# EAGLE design Driver Stage (EAGLE 5.07)
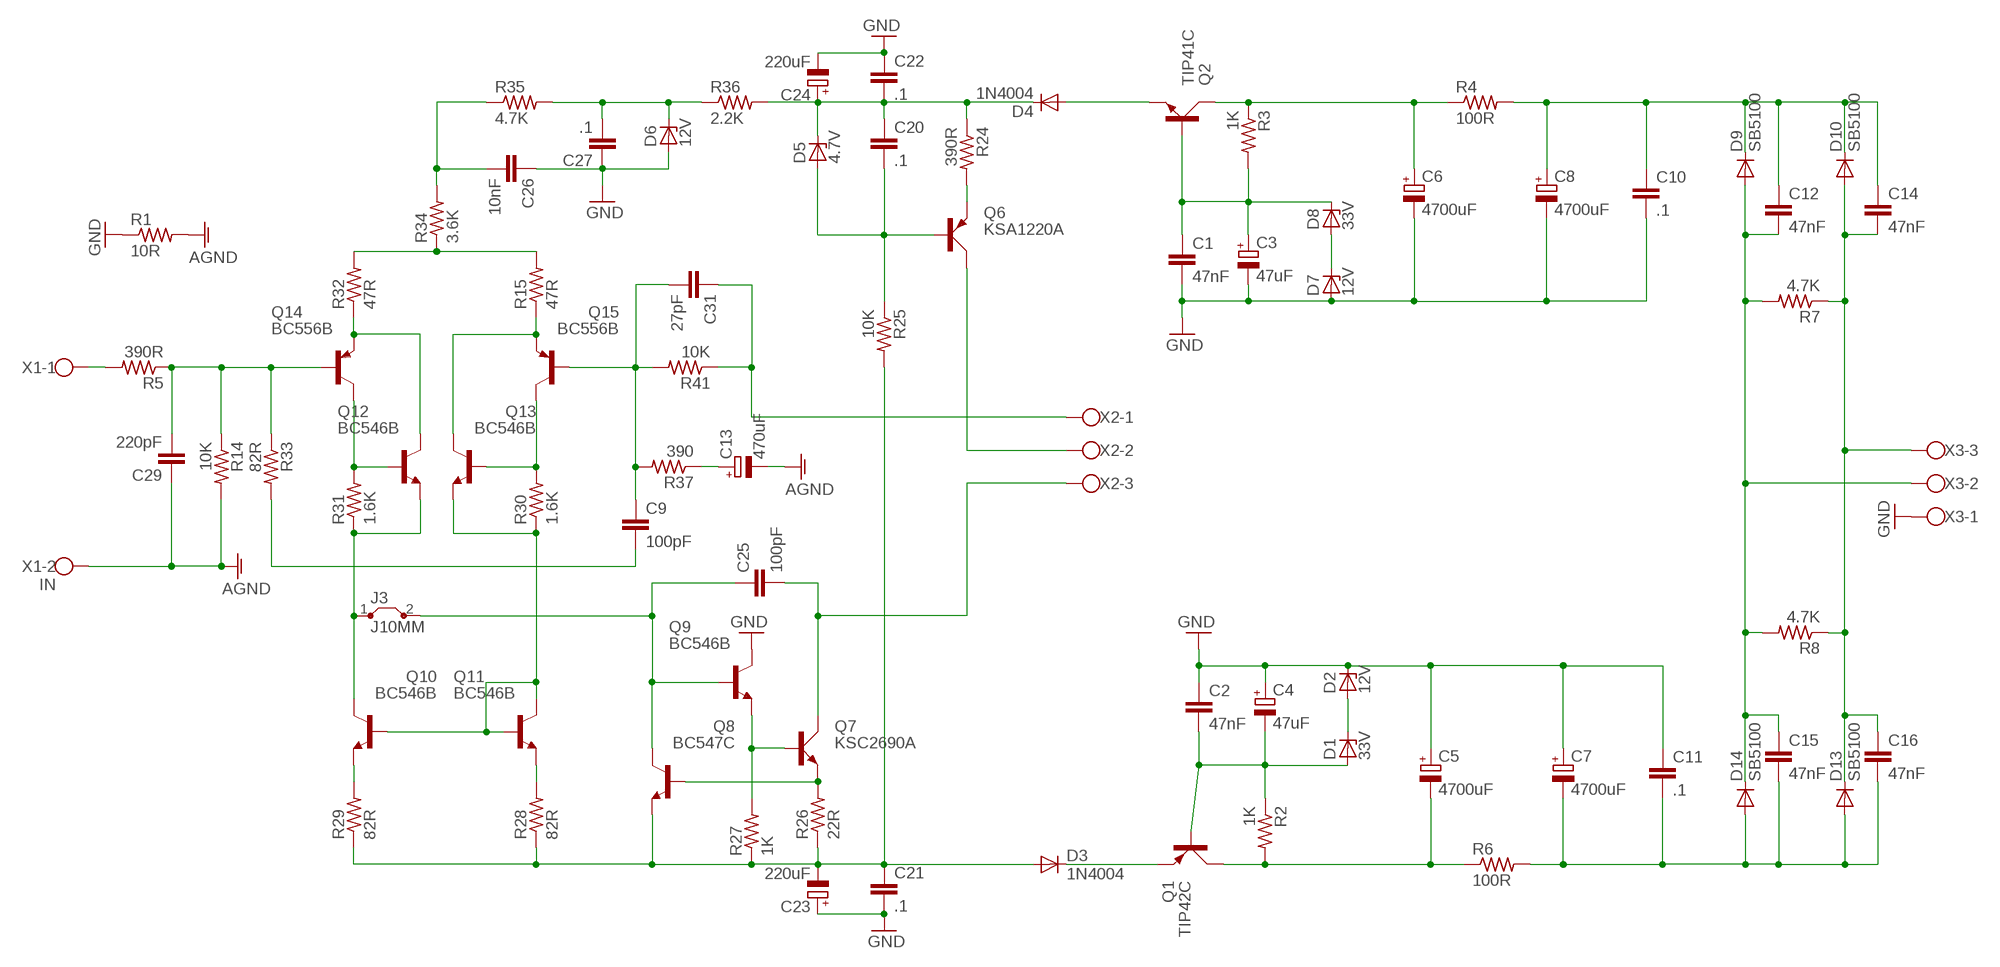
[diagram p0: schematic, sheet 1]

## Parts
C1  47nF  C-EU050-035X075  [C050-035X075]
C2  47nF  C-EU050-035X075  [C050-035X075]
C3  47uF  CPOL-EUE5-10.5  [E5-10,5]
C4  47uF  CPOL-EUE5-10.5  [E5-10,5]
C5  4700uF  CPOL-EUE10-22.5  [EB22,5D]
C6  4700uF  CPOL-EUE10-22.5  [EB22,5D]
C7  4700uF  CPOL-EUE10-22.5  [EB22,5D]
C8  4700uF  CPOL-EUE10-22.5  [EB22,5D]
C9  100pF  C-EU102-043X133  [C102-043X133]
C10  .1  C-EU102-043X133  [C102-043X133]
C11  .1  C-EU102-043X133  [C102-043X133]
C12  47nF  C-EU050-035X075  [C050-035X075]
C13  470uF  CPOL-EUE5-13  [E5-13]
C14  47nF  C-EU050-035X075  [C050-035X075]
C15  47nF  C-EU050-035X075  [C050-035X075]
C16  47nF  C-EU050-035X075  [C050-035X075]
C20  .1  C-EU102-043X133  [C102-043X133]
C21  .1  C-EU102-043X133  [C102-043X133]
C22  .1  C-EU102-043X133  [C102-043X133]
C23  220uF  CPOL-EUE5-13  [E5-13]
C24  220uF  CPOL-EUE5-13  [E5-13]
C25  100pF  C-EU102-043X133  [C102-043X133]
C26  10nF  C-EU050-030X075  [C050-030X075]
C27  .1  C-EU102-043X133  [C102-043X133]
C29  220pF  C-EU050-030X075  [C050-030X075]
C31  27pF  C-EU102-043X133  [C102-043X133]
D1  33V  ZPY  [DO41Z10]
D2  12V  ZPY  [DO41Z10]
D3  1N4004  [DO41-10]
D4  1N4004  [DO41-10]
D5  4.7V  BZX90  [DO34Z7]
D6  12V  BZX90  [DO34Z7]
D7  12V  ZPY  [DO41Z10]
D8  33V  ZPY  [DO41Z10]
D9  SB5100  GI820  [P6-15]
D10  SB5100  GI820  [P6-15]
D13  SB5100  GI820  [P6-15]
D14  SB5100  GI820  [P6-15]
J3  J10MM  [10]
Q1  TIP42C  [TO220AV]
Q2  TIP41C  [TO220AV]
Q6  KSA1220A  BD140  [TO126AV]
Q7  KSC2690A  BD139  [TO126AV]
Q8  BC547C  BC547B-NPN-TO92-EBC  [TO92-EBC]
Q9  BC546B  BC546A  [TO92-EBC]
Q10  BC546B  BC546A  [TO92-EBC]
Q11  BC546B  BC546A  [TO92-EBC]
Q12  BC546B  BC546A  [TO92-EBC]
Q13  BC546B  BC546A  [TO92-EBC]
Q14  BC556B  BC556  [TO92-EBC]
Q15  BC556B  BC556  [TO92-EBC]
R1  10R  R-US_0309/12  [0309/12]
R2  1K  R-US_0309/12  [0309/12]
R3  1K  R-US_0309/12  [0309/12]
R4  100R  R-US_0309/12  [0309/12]
R5  390R  R-US_0309/12  [0309/12]
R6  100R  R-US_0309/12  [0309/12]
R7  4.7K  R-US_0617/22  [0617/22]
R8  4.7K  R-US_0617/22  [0617/22]
R14  10K  R-US_0309/12  [0309/12]
R15  47R  R-US_0309/12  [0309/12]
R24  390R  R-US_0309/12  [0309/12]
R25  10K  R-US_0617/22  [0617/22]
R26  22R  R-US_0309/12  [0309/12]
R27  1K  R-US_0309/12  [0309/12]
R28  82R  R-US_0309/12  [0309/12]
R29  82R  R-US_0309/12  [0309/12]
R30  1.6K  R-US_0309/12  [0309/12]
R31  1.6K  R-US_0309/12  [0309/12]
R32  47R  R-US_0309/12  [0309/12]
R33  82R  R-US_0309/12  [0309/12]
R34  3.6K  R-US_0309/12  [0309/12]
R35  4.7K  R-US_0309/12  [0309/12]
R36  2.2K  R-US_0309/12  [0309/12]
R37  390  R-US_0309/12  [0309/12]
R41  10K  R-US_0309/12  [0309/12]
X1  IN  W237-102  [W237-102]
X2  W237-3E  [W237-3E]
X3  W237-3E  [W237-3E]

## Nets
AGND: C13.- C29.1 R1.2 R14.2 X1.2
GND: C1.2 C2.1 C3.- C4.+ C5.+ C6.- C7.+ C8.- C10.2 C11.1 C21.2 C22.1 C23.+ C24.- C26.1 C27.1 D2.C D6.A D7.A Q9.C R1.1 X3.1
N$1: Q6.C X2.2
N$2: D3.C Q1.E
N$3: C31.1 R41.1 X2.1
N$4: D4.A Q2.E
N$5: C1.1 C3.+ D8.C Q2.B R3.2
N$6: C2.2 C4.- D1.A Q1.B R2.1
N$7: C5.- Q1.C R2.2 R6.1
N$8: C6.+ Q2.C R3.1 R4.1
N$9: D1.C D2.A
N$10: D7.C D8.A
N$11: C12.2 C15.1 D9.A D14.C R7.2 R8.2 X3.2
N$12: C8.+ C10.1 C12.1 C14.1 D9.C D10.C R4.2
N$16: C9.2 R33.2
N$17: C29.2 Q14.B R5.1 R14.1 R33.1
N$20: R5.2 X1.1
N$26: C7.- C11.2 C15.2 C16.2 D13.A D14.A R6.2
N$27: C14.2 C16.1 D10.A D13.C R7.1 R8.1 X3.3
N$30: C20.2 D5.A Q6.B R25.1
N$34: C21.1 C23.- D3.A Q8.E R25.2 R26.1 R27.1 R28.1 R29.1
N$35: C20.1 C22.2 C24.+ D4.C D5.C R24.1 R36.2
N$36: Q6.E R24.2
N$38: Q11.E R28.2
N$39: C26.2 R34.2 R35.1
N$40: Q7.B Q9.E R27.2
N$41: Q7.E Q8.B R26.2
N$42: C25.1 J3.2 Q8.C Q9.B
N$43: Q10.E R29.2
N$44: Q13.C Q15.E R15.1
N$45: Q12.B Q14.C R31.2
N$46: Q10.B Q11.B Q11.C Q13.E R30.1
N$47: Q12.C Q14.E R32.1
N$49: R15.2 R32.2 R34.1
N$51: C27.2 D6.C R35.2 R36.1
N$53: C13.+ R37.1
N$54: Q13.B Q15.C R30.2
N$55: C9.1 C31.2 Q15.B R37.2 R41.2
N$60: J3.1 Q10.C Q12.E R31.1
N$65: C25.2 Q7.C X2.3

## Library data of the parts
C1 C2 C9-C12 C14-C16 C20-C22 C25-C27 C29 C31 = resistor:C-EU: CAPACITOR, European symbol
C3-C8 C13 C23 C24 = resistor:CPOL-EU: POLARIZED CAPACITOR, European symbol
D1 D2 D7 D8 = diode:ZPY: Z DIODE 1 W
D3 D4 = diode:1N4004: DIODE general purpose rectifier, 1 A
D5 D6 = diode:BZX90: Z DIODE
D9 D10 D13 D14 = diode:GI820: DIODE fast-recovery silicon diode, 6 A (Diotec)
J3 = jumper:J: Bridge
Q1 = transistor-power:TIP42C: PNP TRANSISTOR
Q2 = transistor-power:TIP41C: NPN TRANSISTOR
Q6 = transistor-power:BD140: PNP TRANSISTOR
Q7 = transistor-power:BD139: NPN TRANSISTOR
Q8 = transistor:*-NPN-: NPN Transistror BF959 corrected 2008.03.06
Q9-Q13 = transistor-npn:BC546*: NPN Transistor
Q14 Q15 = transistor-pnp:BC556*: PNP Transistror
R1-R8 R14 R15 R24-R37 R41 = resistor:R-US_: RESISTOR, American symbol
X1 = con-wago-500:W237-102: WAGO SCREW CLAMP
X2 X3 = con-wago-508:W237-3E: WAGO SREW CLAMP

## Board
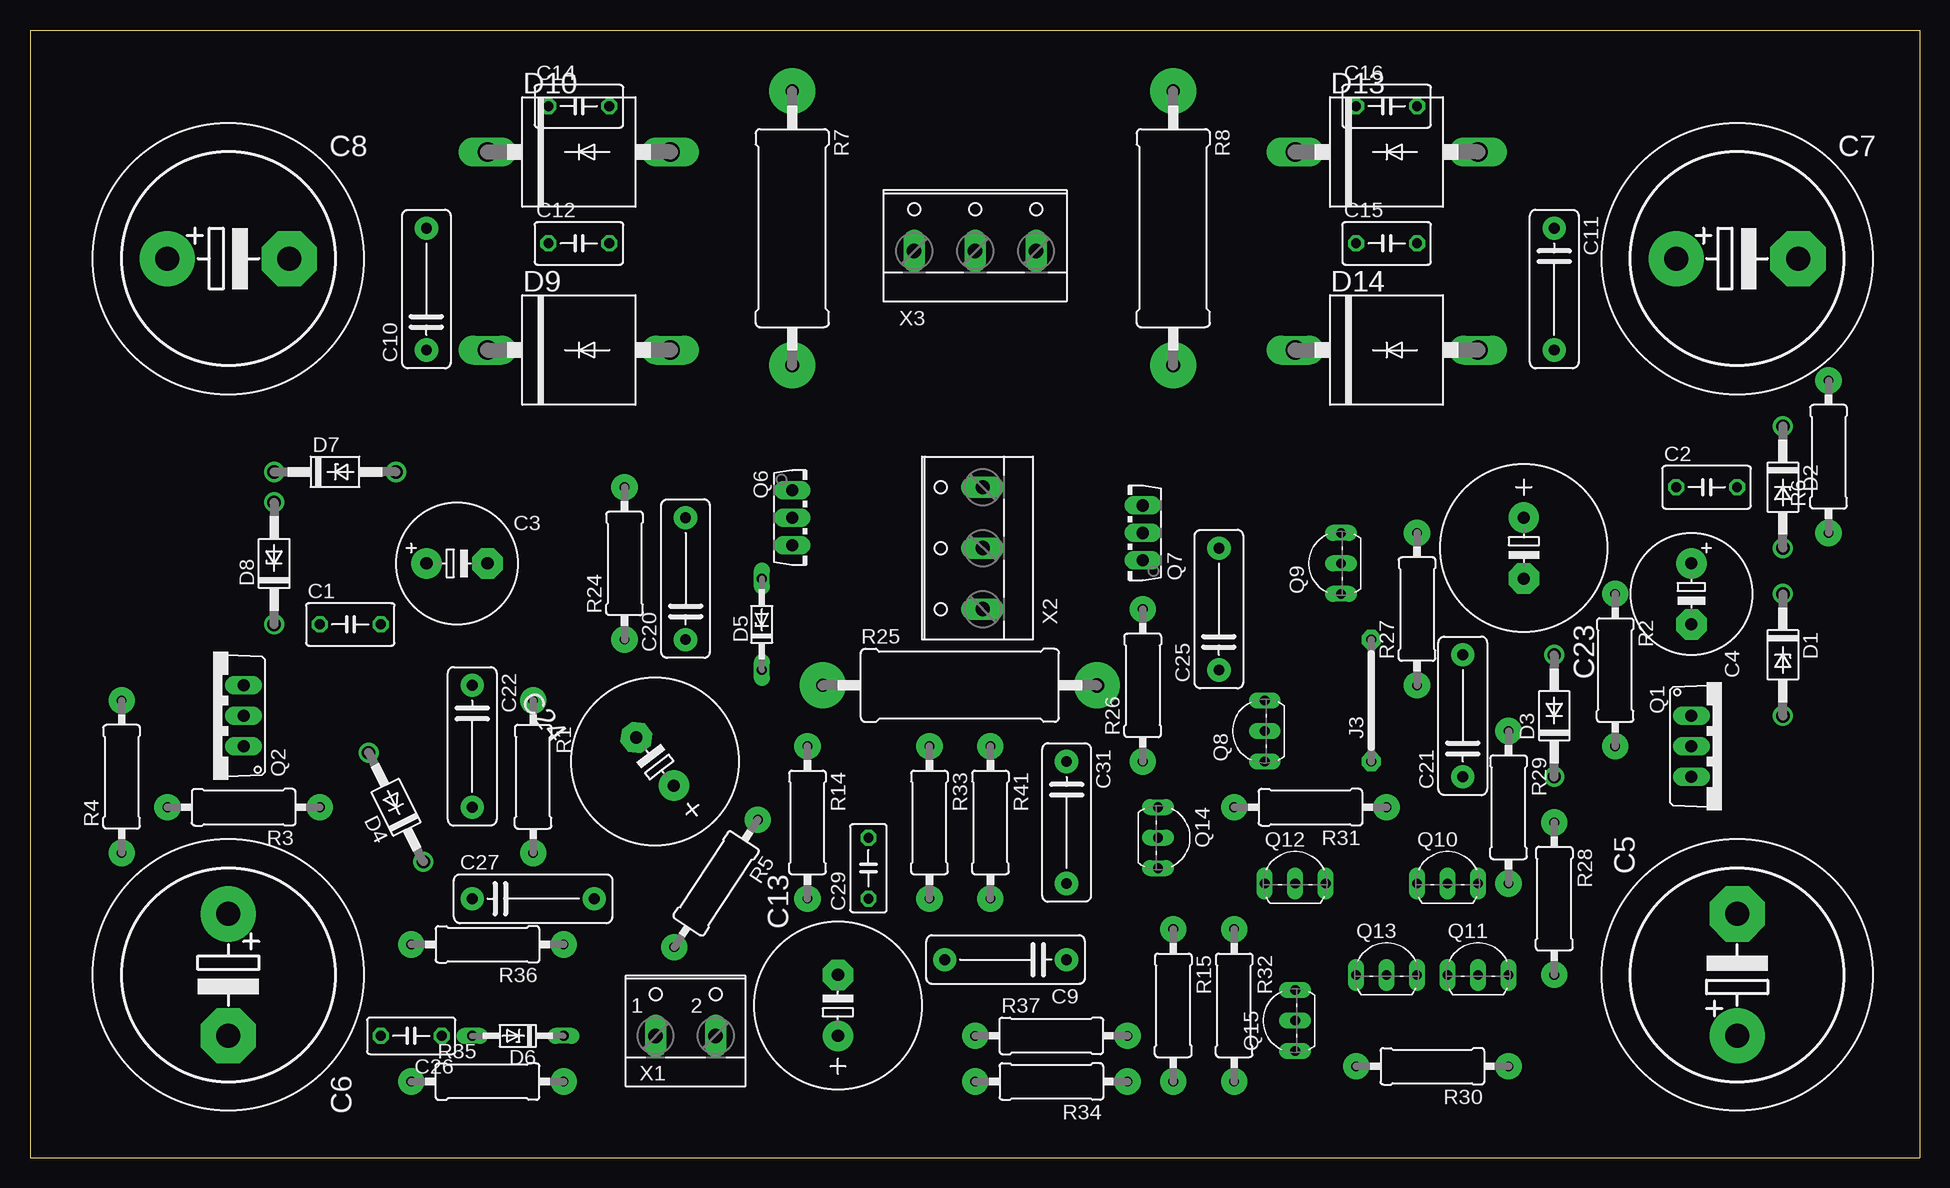
[diagram p1: board, top side]
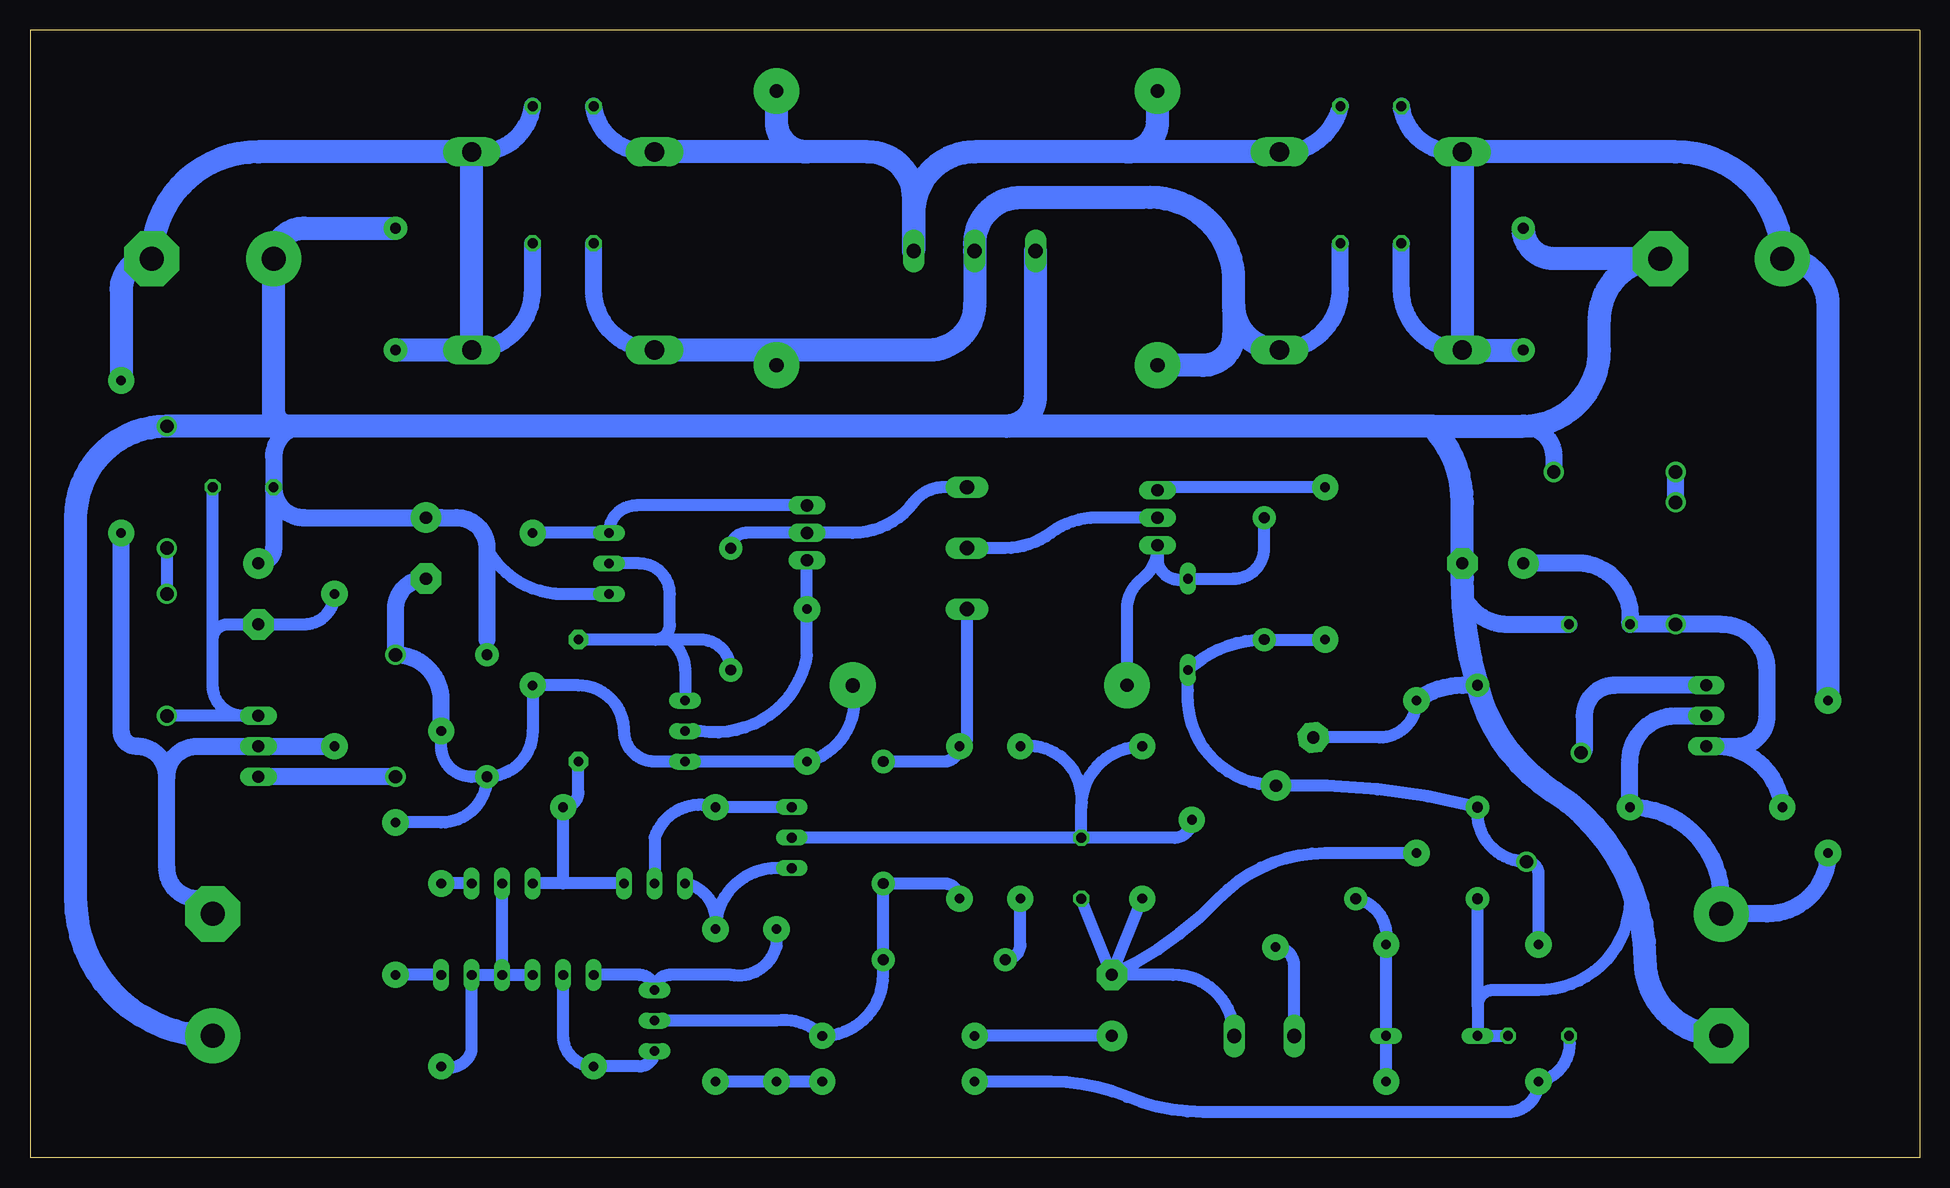
[diagram p2: board, bottom side, seen from below]

Size 157.48 x 93.98 mm. Coordinates in mm from the lower left corner, seen from the top.
Outline: 0.02,93.98 157.48,93.98 157.48,0 0.02,0
Outline: 0,93.98 0,0
Copper layers (1*16): Top 0.035mm / dielectric 1.5mm / Bottom 0.035mm
Design rules "default *": minimum track width 10mil, minimum drill 30mil, track to track 8mil, track to pad 8mil, pad to pad 8mil, via to via 8mil, smd to smd 8mil, copper to edge 40mil, drill to drill 8mil, minimum pad ring 10mil, minimum via ring 8mil, stop-mask expansion 4mil, vias tented up to drill 0mil, thermal gap 10mil
Holes 0.6 mm at -26.65,10.16 -26.65,121.92 186.71,121.92

### Footprints (pad centres in the part's own frame; a part is rotated, then mirrored left to right if it is on the bottom)
C050-035X075 = drill 0.813 octagon: 1 -2.54,0; 2 2.54,0
E5-10,5 = drill 1.016 pad 2.54 round: + -2.54,0 | drill 1.016 pad 2.54 octagon: - 2.54,0
EB22,5D = drill 2.007 pad 4.597 round: + -5.08,0 | drill 2.007 pad 4.597 octagon: - 5.08,0
C102-043X133 = drill 0.9 pad 1.93 round: 1 -5.08,0; 2 5.08,0
E5-13 = drill 1.016 pad 2.54 round: + -2.54,0 | drill 1.016 pad 2.54 octagon: - 2.54,0
C050-030X075 = drill 0.813 octagon: 1 -2.54,0; 2 2.54,0
DO41Z10 = drill 1.118 round: A 5.08,0; C -5.08,0
DO41-10 = drill 1.118 round: A 5.08,0; C -5.08,0
DO34Z7 = drill 0.813 long: A 3.81,0; C -3.81,0
P6-15 = drill 1.6 long: A 7.62,0; C -7.62,0
10 = drill 0.813 pad 1.6 octagon: 1 -5.08,0; 2 5.08,0
TO220AV = drill 1.016 long: B -2.54,-2.54; C 0,-2.54; E 2.54,-2.54
TO126AV = drill 1.016 long: B 2.286,-1.27; C 0,-1.27; E -2.286,-1.27
TO92-EBC = drill 0.813 long: B 0,-1.27; C 2.54,-1.27; E -2.54,-1.27
TO92-EBC' = drill 0.813 long: B 0,-1.27; C -2.54,-1.27; E 2.54,-1.27
0309/12 = drill 0.8 pad 2.184 round: 1 -6.35,0; 2 6.35,0
0617/22 = drill 1.1 pad 3.81 round: 1 -11.43,0 | drill 1.2 pad 3.81 round: 2 11.43,0
W237-102 = drill 1.194 long: 1 -2.5,-1.27; 2 2.5,-1.27
W237-3E = drill 1.194 long: 1 -5.08,-0.635; 2 0,-0.635; 3 5.08,-0.635

### Placement (x,y rotation side)
C1  26.69,44.45 0 top
C2  139.72,55.88 0 top
C3  35.58,49.53 0 top
C4  138.45,46.99 270 top
C5  142.26,15.24 90 top
C6  16.53,15.24 270 top
C7  142.26,74.93 0 top
C8  16.53,74.93 0 top
C9  81.3,16.51 180 top
C10  33.04,72.39 90 top
C11  127.02,72.39 270 top
C12  45.74,76.2 0 top
C13  67.33,12.7 90 top
C14  45.74,87.63 0 top
C15  113.05,76.2 0 top
C16  113.05,87.63 0 top
C20  54.63,48.26 90 top
C21  119.4,36.83 90 top
C22  36.85,34.29 270 top
C23  124.48,50.8 270 top
C24  52.09,33.02 127.8 top
C25  99.08,45.72 90 top
C26  31.77,10.16 180 top
C27  41.93,21.59 0 top
C29  69.87,24.13 90 top
C31  86.38,27.94 270 top
D1  146.07,41.91 270 top
D2  146.07,55.88 270 top
D3  127.02,36.83 90 top
D4  30.5,29.21 116.6 top
D5  60.98,44.45 90 top
D6  40.66,10.16 180 top
D7  25.42,57.15 0 top
D8  20.34,49.53 90 top
D9  45.74,67.31 0 top
D10  45.74,83.82 0 top
D13  113.05,83.82 0 top
D14  113.05,67.31 0 top
J3  111.78,38.1 90 top
Q1  140.99,34.29 270 top
Q2  15.26,36.83 90 top
Q6  64.79,53.34 270 top
Q7  91.46,52.07 90 top
Q8  101.62,35.56 90 top
Q9  BC546B  [TO92-EBC']  107.97,49.53 90 top
Q10  BC546B  [TO92-EBC']  118.13,24.13 0 top
Q11  BC546B  [TO92-EBC']  120.67,16.51 0 top
Q12  BC546B  [TO92-EBC']  105.43,24.13 0 top
Q13  BC546B  [TO92-EBC']  113.05,16.51 0 top
Q14  BC556B  [TO92-EBC']  95.27,26.67 270 top
Q15  BC556B  [TO92-EBC']  104.16,11.43 90 top
R1  41.93,31.75 270 top
R2  132.1,40.64 270 top
R3  17.8,29.21 180 top
R4  7.64,31.75 90 top
R5  57.17,22.86 236.7 top
R6  149.88,58.42 90 top
R7  63.52,77.47 270 top
R8  95.27,77.47 270 top
R14  64.79,27.94 270 top
R15  95.27,12.7 270 top
R24  49.55,49.53 90 top
R25  77.49,39.37 0 top
R26  92.73,39.37 90 top
R27  115.59,45.72 90 top
R28  127.02,21.59 270 top
R29  123.21,29.21 270 top
R30  116.86,7.62 180 top
R31  106.7,29.21 180 top
R32  100.35,12.7 270 top
R33  74.95,27.94 270 top
R34  85.11,6.35 180 top
R35  38.12,6.35 0 top
R36  38.12,17.78 180 top
R37  85.11,10.16 0 top
R41  80.03,27.94 270 top
X1  54.63,11.43 0 top
X2  78.76,50.8 90 top
X3  78.76,76.2 0 top

### Tracks (layer width: path | path; a pad name or v marks a point on that pad's centre or on a via)
AGND
  Bottom 1.016: X1.2 arc-90 62.21,15.24 C13.- | C13.- R14.2 | C13.- C29.1 | R1.2 49.55,25.4 arc-46 58.44,21.59 arc22 C13.-
GND
  Bottom 1.016: Q9.C 113.05,46.99 arc62 119.4,50.8 | 119.4,43.18 C21.2 | C24.- 45,35.03 arc-90 R1.1 | 36.85,12.7 C27.1 | C26.1 D6.A 36.85,12.7 | 36.85,12.7 arc90 35.58,13.97 31.77,13.97 arc-90 24.15,21.59 22.88,16.51
  Bottom 1.422: C23.+ 123.21,53.34 | 119.4,43.18 119.4,50.8 arc-90 121.94,53.34 C23.+ | C23.+ 134.64,53.34 arc90 C2.1 | C4.+ arc-90 137.18,50.8 C2.1 | C1.2 34.31,44.45 arc67 38.12,46.99 arc45 C3.- | C22.1 38.12,39.37 arc-37 R1.1 | D7.A 30.5,58.42 arc-90 33.04,60.96 | C2.1 137.18,58.42 arc90 134.64,60.96
  Bottom 1.93: C11.1 134.64,77.47 arc-90 C7.+ 137.18,62.23 arc-90 135.91,60.96 | C10.2 arc-90 30.5,74.93 C8.- arc-90 26.69,69.85 26.69,67.31 arc90 33.04,60.96 40.66,60.96 | C6.- arc90 22.88,16.51 arc-57 30.5,30.48 arc43 C22.1 arc16 38.12,48.26 C3.- 38.12,54.61 arc-44 40.66,60.96 | X3.1 73.68,63.5 arc90 76.22,60.96 | 40.66,60.96 76.22,60.96 | C5.+ arc90 153.69,21.59 153.69,53.34 arc90 D2.C 135.91,60.96 | 76.22,60.96 134.64,60.96 135.91,60.96
N$1
  Bottom 1.016: Q6.C 68.6,53.34 arc-37 72.41,52.07 arc37 76.22,50.8 X2.2
N$2
  Bottom 1.422: D3.C Q1.E
N$3
  Bottom 1.016: C31.1 81.3,33.02 arc-90 R41.1 arc-90 79.39,34.92 X2.1
N$4
  Bottom 1.422: Q2.E 25.42,39.37 arc-90 27.96,36.83 27.96,34.02 arc90 D4.A
N$5
  Bottom 1.422: C3.+ 27.96,49.53 arc90 C1.1 D8.C 16.53,44.45 arc90 12.72,40.64 12.72,36.83 arc90 15.26,34.29 Q2.B arc90 R3.2
N$6
  Bottom 1.016: Q1.B 139.72,36.83 | 139.72,36.83 D1.A | 142.26,43.18 142.26,39.37 arc-90 139.72,36.83 | 142.26,43.18 C2.2 | 142.26,43.18 arc90 140.99,44.45 139.72,44.45 C4.- 134.64,44.45 arc-90 R2.1
N$7
  Bottom 1.422: R2.2 Q1.C 143.53,34.29 arc-90 146.07,31.75 | C5.- 143.53,21.59 arc90 146.07,24.13 146.07,31.75 | 146.07,31.75 arc-90 148.61,34.29 arc90 149.88,35.56 R6.1
N$8
  Bottom 1.422: Q2.C 20.34,36.83 arc-90 24.15,33.02 R3.1 arc90 16.53,21.59 C6.+ 12.72,20.32 arc-90 R4.1
N$9
  Bottom 1.016: D2.A D1.C
N$10
  Bottom 1.422: D8.A D7.C
N$11
  Bottom 1.422: C15.1 110.51,72.39 arc-90 D14.C | C12.2 48.28,72.39 arc90 D9.A
  Bottom 1.93: D9.A arc90 57.17,71.12 | 57.17,71.12 57.17,72.39 57.17,73.66 arc-90 64.79,80.01 74.95,80.01 arc-90 78.76,76.2 X3.2 78.76,71.12 arc90 82.57,67.31 95.27,67.31 | 95.27,67.31 D14.C 106.7,67.31 | 95.27,67.31 R8.2 | R7.2 59.71,66.04 arc-90 57.17,68.58 57.17,71.12
N$12
  Bottom 1.422: D10.C arc90 C14.1 | C12.1 43.2,72.39 arc-90 D9.C
  Bottom 1.93: C10.1 D9.C D10.C 20.34,83.82 arc90 C8.+ arc90 7.64,71.12 | 7.64,71.12 R4.2 7.64,71.12
N$16
  Bottom 1.016: R33.2 74.95,17.78 arc90 C9.2
N$17
  Bottom 1.016: 69.87,29.21 arc90 R14.1 | C29.2 69.87,29.21 | R33.1 73.68,34.29 arc90 69.87,29.21 | C29.2 Q14.B | R5.1 arc90 62.15,26.67 C29.2
N$20
  Bottom 1.016: R5.2 arc90 52.13,16 X1.1
N$26
  Bottom 1.422: C15.2 115.59,72.39 arc90 D14.A | D13.A arc-90 C16.2
  Bottom 1.93: R6.2 149.88,72.39 arc90 C7.- arc90 138.45,83.82 D13.A D14.A C11.2
N$27
  Bottom 1.422: C14.2 arc90 54.63,83.82 | D13.C arc90 C16.1
  Bottom 1.93: D10.A 54.63,83.82 66.06,83.82 | 66.06,83.82 78.76,83.82 arc-90 83.84,78.74 X3.3 83.84,80.01 arc-90 87.65,83.82 92.73,83.82 | 92.73,83.82 D13.C | R7.1 63.52,86.36 arc90 66.06,83.82 | R8.1 95.27,86.36 arc-90 92.73,83.82
N$30
  Bottom 1.016: C20.2 54.63,50.8 arc90 57.17,48.26 D5.A arc90 63.52,49.53 Q6.B arc57 64.79,48.26 arc-53 66.06,45.72 R25.1
N$34
  Bottom 1.016: R25.2 arc90 R26.1 Q8.E 105.43,33.02 arc90 107.97,35.56 arc-90 111.78,39.37 R27.1 115.59,35.56 arc90 C21.1 | C21.1 120.67,31.75 arc90 123.21,34.29 R29.1 | R28.1 123.21,27.94 arc-90 C21.1
  Bottom 1.422: C23.- arc-90 127.02,45.72 D3.A arc90 123.21,38.1 R29.1
N$35
  Bottom 1.016: D5.C arc44 C20.1 | D5.C arc44 C20.1 | C20.1 R24.1 | D5.C arc-4 60.98,38.1 arc-88 C24.+ arc16 C22.2 36.85,28.74 arc-90 D4.C arc90 31.77,23.66 R36.2
N$36
  Bottom 1.016: R24.2 63.52,55.88 Q6.E
N$38
  Bottom 1.016: Q11.E R28.2
N$39
  Bottom 1.016: C26.2 arc90 R35.1 arc90 34.31,3.81 59.71,3.81 arc23 66.06,5.08 arc-23 72.41,6.35 R34.2
N$40
  Bottom 1.016: R27.2 Q9.E arc90 106.95,54.36 Q7.B
N$41
  Bottom 1.016: Q8.B 101.62,35.56 arc-90 92.73,41.91 R26.2 Q7.E
N$42
  Bottom 1.016: 104.16,43.18 101.62,43.18 arc90 C25.1 | 104.16,43.18 105.43,43.18 | 105.43,43.18 J3.2 | Q9.B 106.7,49.53 arc90 104.16,46.99 104.16,44.45 arc90 105.43,43.18 | Q8.C 102.89,40.64 arc-53 104.16,43.18
N$43
  Bottom 1.016: Q10.E R29.2
N$44
  Bottom 1.016: R15.1 95.27,17.78 arc90 99.08,15.24 104.16,15.24 arc-90 Q15.E arc-90 106.7,15.24 Q13.C
N$45
  Bottom 1.016: Q14.C R31.2 arc-90 105.43,26.67 Q12.B
N$46
  Bottom 1.016: Q11.C Q13.E | Q11.C Q11.B 120.67,8.89 arc90 R30.1 | Q11.C Q10.B
N$47
  Bottom 1.016: Q14.E 95.27,24.13 arc-90 R32.1 arc-90 Q12.C
N$49
  Bottom 1.016: R32.2 R15.2 R34.1
N$51
  Bottom 1.016: R35.2 D6.C R36.1 arc-90 C27.2
N$53
  Bottom 1.016: C13.+ R37.1
N$54
  Bottom 1.016: Q15.C arc90 106.7,7.62 R30.2 arc90 113.05,10.16 Q13.B
N$55
  Bottom 1.016: Q15.B 95.27,11.43 arc53 R37.2 arc-90 86.38,15.24 C9.1 C31.2 81.3,22.86 | 81.3,22.86 arc90 R41.2 arc-90 81.3,22.86
N$60
  Bottom 1.016: Q12.E 113.05,22.86 | 113.05,22.86 Q10.C | 113.05,22.86 R31.1 arc-90 111.78,30.48 J3.1
N$65
  Bottom 1.016: C25.2 arc90 97.81,52.07 Q7.C 88.92,52.07 arc-53 83.84,54.61 arc53 81.3,55.88 X2.3